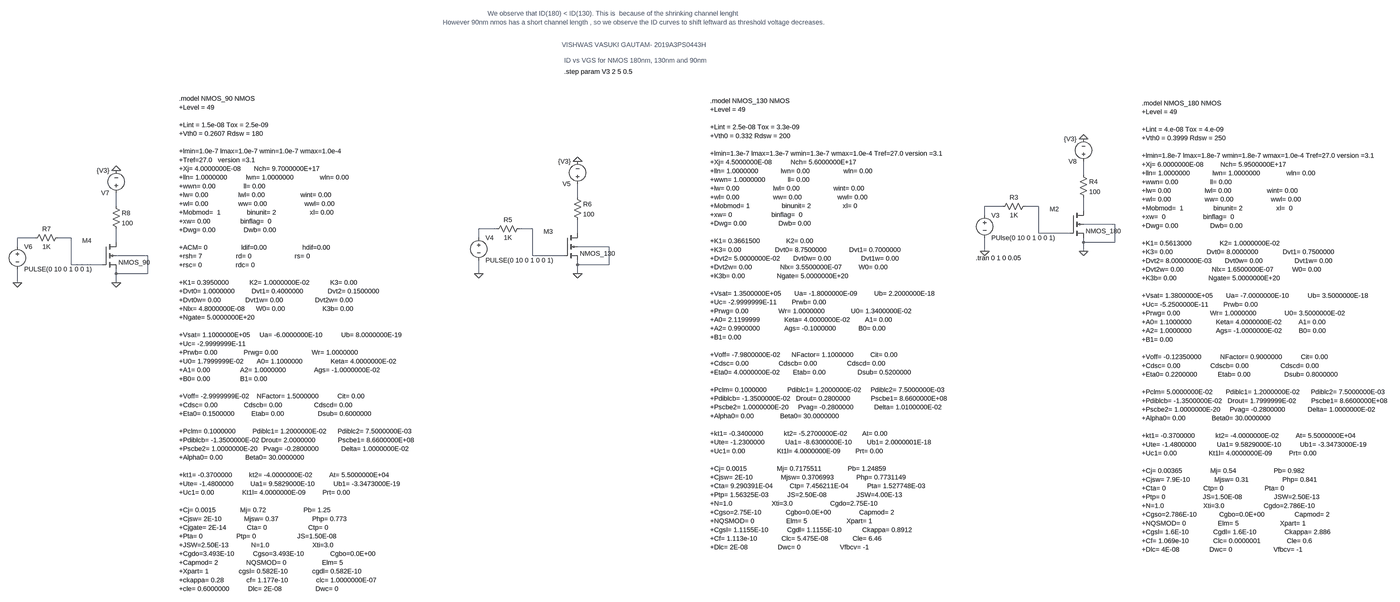
[diagram p0: schematic NMOS_IDvsVGS.asc, whole sheet]
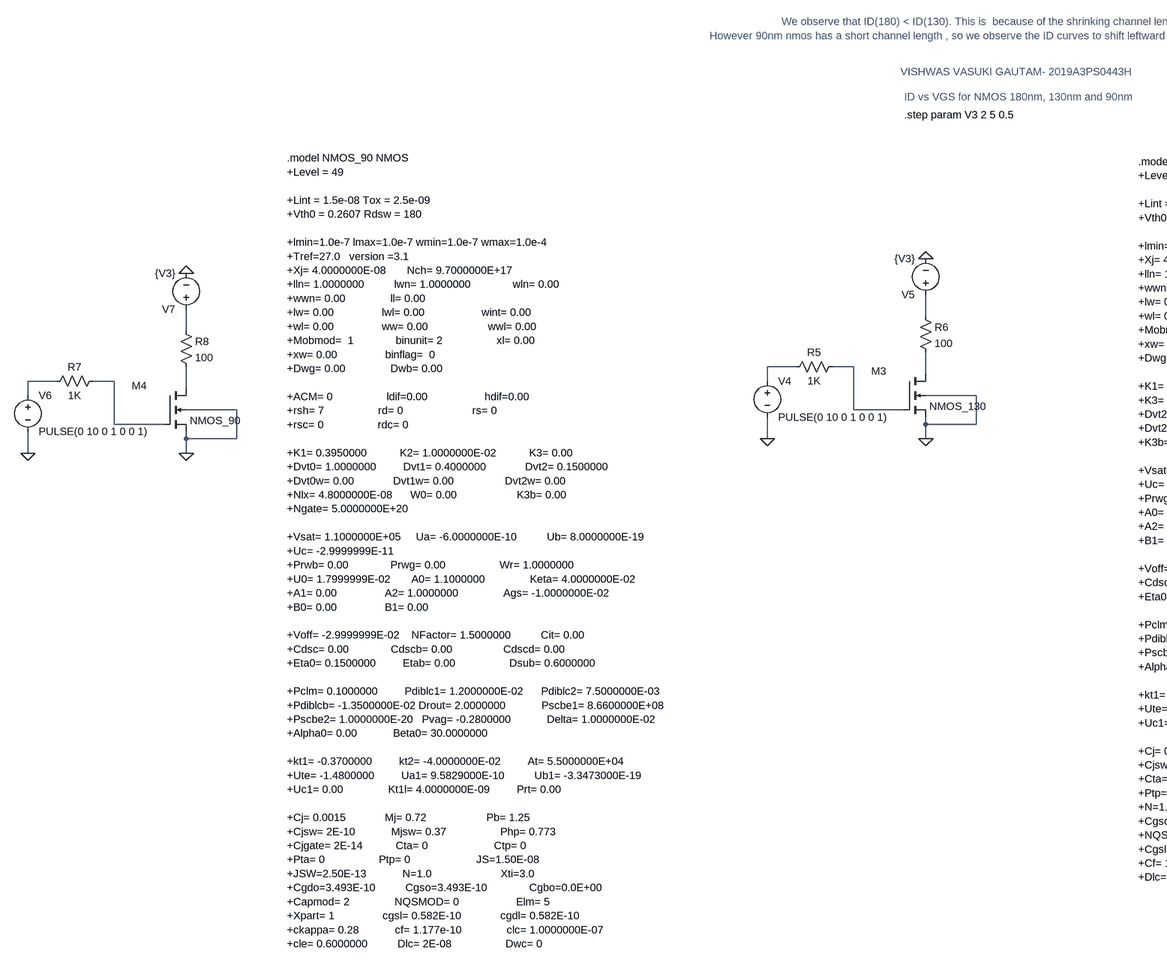
[diagram p1: schematic NMOS_IDvsVGS.asc, part, row 1 of 1, column 1 of 2]
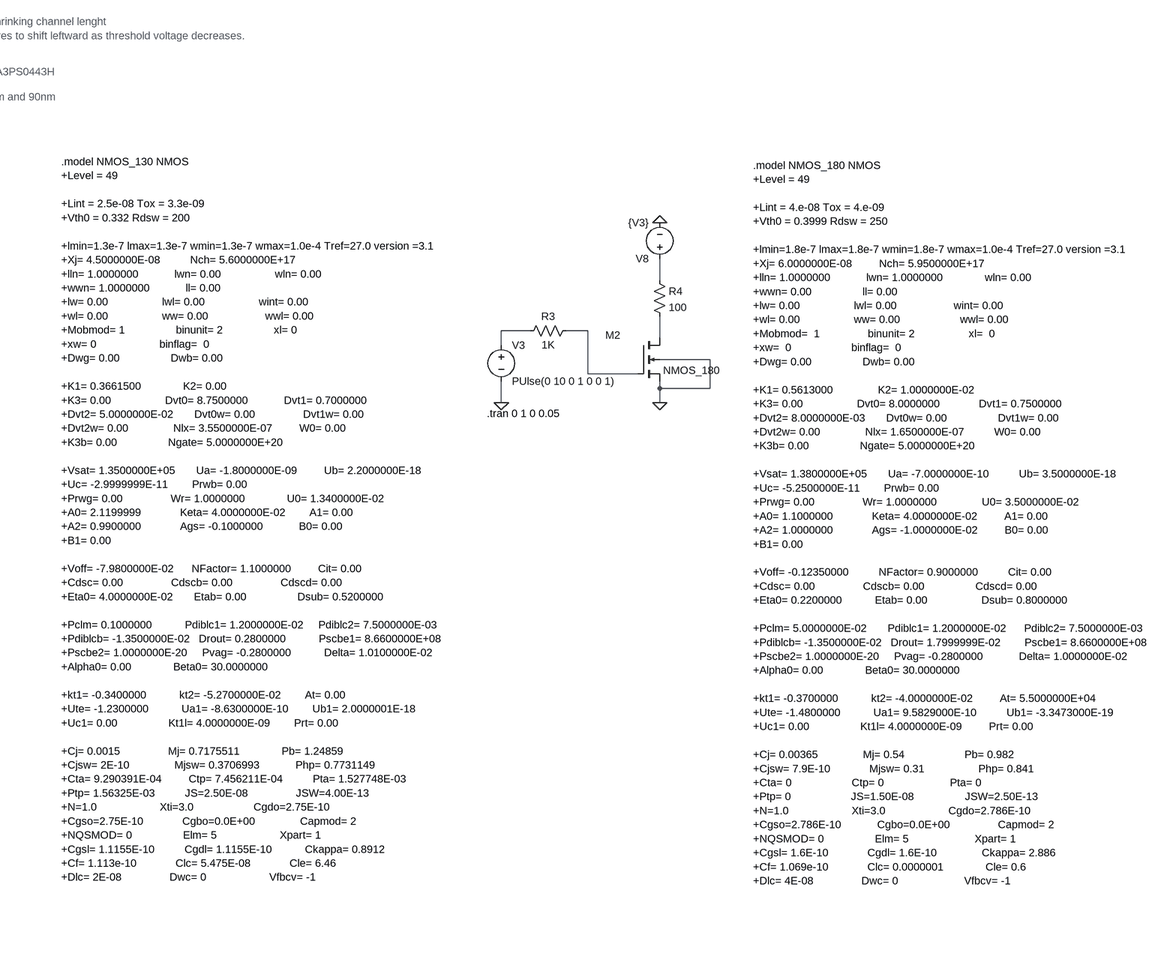
[diagram p2: schematic NMOS_IDvsVGS.asc, part, row 1 of 1, column 2 of 2]
NMOS_IDvsVGS.asc, the LTspice schematic file:
Version 4
SHEET 1 1936 1352
WIRE -608 -240 -608 -288
WIRE -2560 -160 -2560 -208
WIRE -4560 -128 -4560 -176
WIRE -896 -128 -960 -128
WIRE -768 -128 -816 -128
WIRE -608 -112 -608 -160
WIRE -960 -96 -960 -128
WIRE -496 -64 -608 -64
WIRE -2848 -48 -2912 -48
WIRE -2720 -48 -2768 -48
WIRE -2560 -32 -2560 -80
WIRE -768 -32 -768 -128
WIRE -656 -32 -768 -32
WIRE -4848 -16 -4912 -16
WIRE -4720 -16 -4768 -16
WIRE -2912 -16 -2912 -48
WIRE -4560 0 -4560 -48
WIRE -608 0 -608 -16
WIRE -496 0 -496 -64
WIRE -496 0 -608 0
WIRE -4912 16 -4912 -16
WIRE -2448 16 -2560 16
WIRE -960 32 -960 -16
WIRE -608 32 -608 0
WIRE -4448 48 -4560 48
WIRE -2720 48 -2720 -48
WIRE -2608 48 -2720 48
WIRE -4720 80 -4720 -16
WIRE -4608 80 -4720 80
WIRE -2560 80 -2560 64
WIRE -2448 80 -2448 16
WIRE -2448 80 -2560 80
WIRE -4560 112 -4560 96
WIRE -4448 112 -4448 48
WIRE -4448 112 -4560 112
WIRE -2912 112 -2912 64
WIRE -2560 112 -2560 80
WIRE -4912 144 -4912 96
WIRE -4560 144 -4560 112
FLAG -608 32 0
FLAG -960 32 0
FLAG -2560 112 0
FLAG -2912 112 0
FLAG -4560 144 0
FLAG -4912 144 0
FLAG -608 -368 0
FLAG -2560 -288 0
FLAG -4560 -256 0
SYMBOL res -800 -144 R90
WINDOW 0 0 56 VBottom 2
WINDOW 3 32 56 VTop 2
SYMATTR InstName R3
SYMATTR Value 1K
SYMBOL res -624 -256 R0
SYMATTR InstName R4
SYMATTR Value 100
SYMBOL voltage -960 -112 R0
WINDOW 123 0 0 Left 2
WINDOW 39 0 0 Left 2
SYMATTR InstName V3
SYMATTR Value PUlse(0 10 0 1 0 0 1)
SYMBOL nmos4 -656 -112 R0
WINDOW 0 -73 -6 Left 2
SYMATTR InstName M2
SYMATTR Value NMOS_180
SYMATTR Value2 l=0.5u w=10u
SYMBOL res -2752 -64 R90
WINDOW 0 0 56 VBottom 2
WINDOW 3 32 56 VTop 2
SYMATTR InstName R5
SYMATTR Value 1K
SYMBOL res -2576 -176 R0
SYMATTR InstName R6
SYMATTR Value 100
SYMBOL voltage -2912 -32 R0
WINDOW 123 0 0 Left 2
WINDOW 39 0 0 Left 2
SYMATTR InstName V4
SYMATTR Value PULSE(0 10 0 1 0 0 1)
SYMBOL voltage -2560 -192 R180
WINDOW 123 0 0 Left 2
WINDOW 39 0 0 Left 2
SYMATTR InstName V5
SYMATTR Value {V3}
SYMBOL nmos4 -2608 -32 R0
WINDOW 0 -73 -6 Left 2
SYMATTR InstName M3
SYMATTR Value NMOS_130
SYMATTR Value2 l=0.5u w=10u
SYMBOL res -4752 -32 R90
WINDOW 0 0 56 VBottom 2
WINDOW 3 32 56 VTop 2
SYMATTR InstName R7
SYMATTR Value 1K
SYMBOL res -4576 -144 R0
SYMATTR InstName R8
SYMATTR Value 100
SYMBOL voltage -4912 0 R0
WINDOW 123 0 0 Left 2
WINDOW 39 0 0 Left 2
SYMATTR InstName V6
SYMATTR Value PULSE(0 10 0 1 0 0 1)
SYMBOL voltage -4560 -160 R180
WINDOW 123 0 0 Left 2
WINDOW 39 0 0 Left 2
SYMATTR InstName V7
SYMATTR Value {V3}
SYMBOL nmos4 -4608 0 R0
WINDOW 0 -73 -6 Left 2
SYMATTR InstName M4
SYMATTR Value NMOS_90
SYMATTR Value2 l=0.5u w=10u
SYMBOL voltage -608 -272 R180
WINDOW 123 0 0 Left 2
WINDOW 39 0 0 Left 2
SYMATTR InstName V8
SYMATTR Value {V3}
TEXT -992 56 Left 2 !.tran 0 1 0 0.05
TEXT -2608 -608 Left 2 !.step param V3 2 5 0.5
TEXT -2880 -816 Left 2 ;We observe that ID(180) < ID(130). This is  because of the shrinking channel lenght
TEXT -3040 -784 Left 2 ;However 90nm nmos has a short channel length , so we observe the ID curves to shift leftward as threshold voltage decreases.
TEXT -2608 -648 Left 2 ;ID vs VGS for NMOS 180nm, 130nm and 90nm
TEXT -400 -496 Left 2 !.model NMOS_180 NMOS\n+Level = 49\n \n+Lint = 4.e-08 Tox = 4.e-09 \n+Vth0 = 0.3999 Rdsw = 250 \n \n+lmin=1.8e-7 lmax=1.8e-7 wmin=1.8e-7 wmax=1.0e-4 Tref=27.0 version =3.1\n+Xj= 6.0000000E-08         Nch= 5.9500000E+17 \n+lln= 1.0000000            lwn= 1.0000000              wln= 0.00\n+wwn= 0.00                 ll= 0.00\n+lw= 0.00                  lwl= 0.00                   wint= 0.00\n+wl= 0.00                  ww= 0.00                    wwl= 0.00\n+Mobmod=  1                binunit= 2                  xl=  0\n+xw=  0                    binflag=  0\n+Dwg= 0.00                 Dwb= 0.00 \n \n+K1= 0.5613000               K2= 1.0000000E-02 \n+K3= 0.00                  Dvt0= 8.0000000             Dvt1= 0.7500000 \n+Dvt2= 8.0000000E-03       Dvt0w= 0.00                 Dvt1w= 0.00 \n+Dvt2w= 0.00               Nlx= 1.6500000E-07          W0= 0.00 \n+K3b= 0.00                 Ngate= 5.0000000E+20 \n \n+Vsat= 1.3800000E+05       Ua= -7.0000000E-10          Ub= 3.5000000E-18 \n+Uc= -5.2500000E-11        Prwb= 0.00 \n+Prwg= 0.00                Wr= 1.0000000               U0= 3.5000000E-02 \n+A0= 1.1000000             Keta= 4.0000000E-02         A1= 0.00 \n+A2= 1.0000000             Ags= -1.0000000E-02         B0= 0.00 \n+B1= 0.00 \n \n+Voff= -0.12350000          NFactor= 0.9000000          Cit= 0.00 \n+Cdsc= 0.00                Cdscb= 0.00                 Cdscd= 0.00 \n+Eta0= 0.2200000           Etab= 0.00                  Dsub= 0.8000000 \n \n+Pclm= 5.0000000E-02       Pdiblc1= 1.2000000E-02      Pdiblc2= 7.5000000E-03 \n+Pdiblcb= -1.3500000E-02   Drout= 1.7999999E-02        Pscbe1= 8.6600000E+08 \n+Pscbe2= 1.0000000E-20     Pvag= -0.2800000            Delta= 1.0000000E-02 \n+Alpha0= 0.00              Beta0= 30.0000000 \n \n+kt1= -0.3700000           kt2= -4.0000000E-02         At= 5.5000000E+04 \n+Ute= -1.4800000           Ua1= 9.5829000E-10          Ub1= -3.3473000E-19 \n+Uc1= 0.00                 Kt1l= 4.0000000E-09         Prt= 0.00 \n \n+Cj= 0.00365               Mj= 0.54                    Pb= 0.982\n+Cjsw= 7.9E-10             Mjsw= 0.31                  Php= 0.841\n+Cta= 0                    Ctp= 0                      Pta= 0\n+Ptp= 0                    JS=1.50E-08                 JSW=2.50E-13\n+N=1.0                     Xti=3.0                     Cgdo=2.786E-10\n+Cgso=2.786E-10            Cgbo=0.0E+00                Capmod= 2\n+NQSMOD= 0                 Elm= 5                      Xpart= 1\n+Cgsl= 1.6E-10             Cgdl= 1.6E-10               Ckappa= 2.886\n+Cf= 1.069e-10             Clc= 0.0000001              Cle= 0.6\n+Dlc= 4E-08                Dwc= 0                      Vfbcv= -1
TEXT -2088 -504 Left 2 !.model NMOS_130 NMOS\n+Level = 49\n \n+Lint = 2.5e-08 Tox = 3.3e-09 \n+Vth0 = 0.332 Rdsw = 200 \n \n+lmin=1.3e-7 lmax=1.3e-7 wmin=1.3e-7 wmax=1.0e-4 Tref=27.0 version =3.1\n+Xj= 4.5000000E-08          Nch= 5.6000000E+17 \n+lln= 1.0000000            lwn= 0.00                  wln= 0.00\n+wwn= 1.0000000            ll= 0.00\n+lw= 0.00                  lwl= 0.00                  wint= 0.00\n+wl= 0.00                  ww= 0.00                   wwl= 0.00\n+Mobmod= 1                 binunit= 2                 xl= 0\n+xw= 0                     binflag=  0\n+Dwg= 0.00                 Dwb= 0.00 \n \n+K1= 0.3661500              K2= 0.00 \n+K3= 0.00                  Dvt0= 8.7500000            Dvt1= 0.7000000 \n+Dvt2= 5.0000000E-02       Dvt0w= 0.00                Dvt1w= 0.00 \n+Dvt2w= 0.00               Nlx= 3.5500000E-07         W0= 0.00 \n+K3b= 0.00                 Ngate= 5.0000000E+20 \n \n+Vsat= 1.3500000E+05       Ua= -1.8000000E-09         Ub= 2.2000000E-18 \n+Uc= -2.9999999E-11        Prwb= 0.00 \n+Prwg= 0.00                Wr= 1.0000000              U0= 1.3400000E-02 \n+A0= 2.1199999             Keta= 4.0000000E-02        A1= 0.00 \n+A2= 0.9900000             Ags= -0.1000000            B0= 0.00 \n+B1= 0.00 \n \n+Voff= -7.9800000E-02      NFactor= 1.1000000         Cit= 0.00 \n+Cdsc= 0.00                Cdscb= 0.00                Cdscd= 0.00 \n+Eta0= 4.0000000E-02       Etab= 0.00                 Dsub= 0.5200000 \n \n+Pclm= 0.1000000           Pdiblc1= 1.2000000E-02     Pdiblc2= 7.5000000E-03 \n+Pdiblcb= -1.3500000E-02   Drout= 0.2800000           Pscbe1= 8.6600000E+08 \n+Pscbe2= 1.0000000E-20     Pvag= -0.2800000           Delta= 1.0100000E-02 \n+Alpha0= 0.00              Beta0= 30.0000000 \n \n+kt1= -0.3400000           kt2= -5.2700000E-02        At= 0.00 \n+Ute= -1.2300000           Ua1= -8.6300000E-10        Ub1= 2.0000001E-18 \n+Uc1= 0.00                 Kt1l= 4.0000000E-09        Prt= 0.00 \n \n+Cj= 0.0015                Mj= 0.7175511              Pb= 1.24859\n+Cjsw= 2E-10               Mjsw= 0.3706993            Php= 0.7731149\n+Cta= 9.290391E-04         Ctp= 7.456211E-04          Pta= 1.527748E-03\n+Ptp= 1.56325E-03          JS=2.50E-08                JSW=4.00E-13\n+N=1.0                     Xti=3.0                    Cgdo=2.75E-10\n+Cgso=2.75E-10             Cgbo=0.0E+00               Capmod= 2\n+NQSMOD= 0                 Elm= 5                     Xpart= 1\n+Cgsl= 1.1155E-10          Cgdl= 1.1155E-10           Ckappa= 0.8912\n+Cf= 1.113e-10             Clc= 5.475E-08             Cle= 6.46\n+Dlc= 2E-08                Dwc= 0                     Vfbcv= -1
TEXT -4296 -512 Left 2 !.model NMOS_90 NMOS\n+Level = 49\n \n+Lint = 1.5e-08 Tox = 2.5e-09 \n+Vth0 = 0.2607 Rdsw = 180 \n \n+lmin=1.0e-7 lmax=1.0e-7 wmin=1.0e-7 wmax=1.0e-4\n+Tref=27.0   version =3.1\n+Xj= 4.0000000E-08       Nch= 9.7000000E+17 \n+lln= 1.0000000          lwn= 1.0000000              wln= 0.00\n+wwn= 0.00               ll= 0.00\n+lw= 0.00                lwl= 0.00                   wint= 0.00\n+wl= 0.00                ww= 0.00                    wwl= 0.00\n+Mobmod=  1              binunit= 2                  xl= 0.00\n+xw= 0.00                binflag=  0\n+Dwg= 0.00               Dwb= 0.00 \n \n+ACM= 0                  ldif=0.00                   hdif=0.00\n+rsh= 7                  rd= 0                       rs= 0\n+rsc= 0                  rdc= 0\n \n+K1= 0.3950000           K2= 1.0000000E-02           K3= 0.00 \n+Dvt0= 1.0000000         Dvt1= 0.4000000             Dvt2= 0.1500000 \n+Dvt0w= 0.00             Dvt1w= 0.00                 Dvt2w= 0.00 \n+Nlx= 4.8000000E-08      W0= 0.00                    K3b= 0.00 \n+Ngate= 5.0000000E+20 \n \n+Vsat= 1.1000000E+05     Ua= -6.0000000E-10          Ub= 8.0000000E-19 \n+Uc= -2.9999999E-11       \n+Prwb= 0.00              Prwg= 0.00                  Wr= 1.0000000 \n+U0= 1.7999999E-02       A0= 1.1000000               Keta= 4.0000000E-02 \n+A1= 0.00                A2= 1.0000000               Ags= -1.0000000E-02\n+B0= 0.00                B1= 0.00 \n \n+Voff= -2.9999999E-02    NFactor= 1.5000000          Cit= 0.00 \n+Cdsc= 0.00              Cdscb= 0.00                 Cdscd= 0.00 \n+Eta0= 0.1500000         Etab= 0.00                  Dsub= 0.6000000 \n \n+Pclm= 0.1000000         Pdiblc1= 1.2000000E-02      Pdiblc2= 7.5000000E-03\n+Pdiblcb= -1.3500000E-02 Drout= 2.0000000            Pscbe1= 8.6600000E+08\n+Pscbe2= 1.0000000E-20   Pvag= -0.2800000            Delta= 1.0000000E-02\n+Alpha0= 0.00            Beta0= 30.0000000 \n \n+kt1= -0.3700000         kt2= -4.0000000E-02         At= 5.5000000E+04 \n+Ute= -1.4800000         Ua1= 9.5829000E-10          Ub1= -3.3473000E-19\n+Uc1= 0.00               Kt1l= 4.0000000E-09         Prt= 0.00 \n \n+Cj= 0.0015             Mj= 0.72                    Pb= 1.25 \n+Cjsw= 2E-10            Mjsw= 0.37                  Php= 0.773\n+Cjgate= 2E-14           Cta= 0                      Ctp= 0\n+Pta= 0                  Ptp= 0                      JS=1.50E-08\n+JSW=2.50E-13            N=1.0                       Xti=3.0\n+Cgdo=3.493E-10          Cgso=3.493E-10              Cgbo=0.0E+00\n+Capmod= 2               NQSMOD= 0                   Elm= 5\n+Xpart= 1                cgsl= 0.582E-10             cgdl= 0.582E-10\n+ckappa= 0.28            cf= 1.177e-10               clc= 1.0000000E-07\n+cle= 0.6000000          Dlc= 2E-08                  Dwc= 0
TEXT -2616 -704 Left 2 ;VISHWAS VASUKI GAUTAM- 2019A3PS0443H

The netlist it stands for:
* NMOS_IDvsVGS.asc
R3 N005 N004 1K
R4 N001 N006 100
V3 N004 0 PUlse(0 10 0 1 0 0 1)
M2 N006 N005 0 0 NMOS_180 l=0.5u w=10u
R5 N008 N007 1K
R6 N002 N009 100
V4 N007 0 PULSE(0 10 0 1 0 0 1)
V5 N002 0 {V3}
M3 N009 N008 0 0 NMOS_130 l=0.5u w=10u
R7 N011 N010 1K
R8 N003 N012 100
V6 N010 0 PULSE(0 10 0 1 0 0 1)
V7 N003 0 {V3}
M4 N012 N011 0 0 NMOS_90 l=0.5u w=10u
V8 N001 0 {V3}
.model NMOS NMOS
.model PMOS PMOS
.lib standard.mos
.tran 0 1 0 0.05
.step param V3 2 5 0.5
* We observe that ID(180) < ID(130). This is  because of the shrinking channel lenght
* However 90nm nmos has a short channel length , so we observe the ID curves to shift leftward as threshold voltage decreases.
* ID vs VGS for NMOS 180nm, 130nm and 90nm
.model NMOS_180 NMOS
+Level = 49
+Lint = 4.e-08 Tox = 4.e-09
+Vth0 = 0.3999 Rdsw = 250
+lmin=1.8e-7 lmax=1.8e-7 wmin=1.8e-7 wmax=1.0e-4 Tref=27.0 version =3.1
+Xj= 6.0000000E-08         Nch= 5.9500000E+17
+lln= 1.0000000            lwn= 1.0000000              wln= 0.00
+wwn= 0.00                 ll= 0.00
+lw= 0.00                  lwl= 0.00                   wint= 0.00
+wl= 0.00                  ww= 0.00                    wwl= 0.00
+Mobmod=  1                binunit= 2                  xl=  0
+xw=  0                    binflag=  0
+Dwg= 0.00                 Dwb= 0.00
+K1= 0.5613000               K2= 1.0000000E-02
+K3= 0.00                  Dvt0= 8.0000000             Dvt1= 0.7500000
+Dvt2= 8.0000000E-03       Dvt0w= 0.00                 Dvt1w= 0.00
+Dvt2w= 0.00               Nlx= 1.6500000E-07          W0= 0.00
+K3b= 0.00                 Ngate= 5.0000000E+20
+Vsat= 1.3800000E+05       Ua= -7.0000000E-10          Ub= 3.5000000E-18
+Uc= -5.2500000E-11        Prwb= 0.00
+Prwg= 0.00                Wr= 1.0000000               U0= 3.5000000E-02
+A0= 1.1000000             Keta= 4.0000000E-02         A1= 0.00
+A2= 1.0000000             Ags= -1.0000000E-02         B0= 0.00
+B1= 0.00
+Voff= -0.12350000          NFactor= 0.9000000          Cit= 0.00
+Cdsc= 0.00                Cdscb= 0.00                 Cdscd= 0.00
+Eta0= 0.2200000           Etab= 0.00                  Dsub= 0.8000000
+Pclm= 5.0000000E-02       Pdiblc1= 1.2000000E-02      Pdiblc2= 7.5000000E-03
+Pdiblcb= -1.3500000E-02   Drout= 1.7999999E-02        Pscbe1= 8.6600000E+08
+Pscbe2= 1.0000000E-20     Pvag= -0.2800000            Delta= 1.0000000E-02
+Alpha0= 0.00              Beta0= 30.0000000
+kt1= -0.3700000           kt2= -4.0000000E-02         At= 5.5000000E+04
+Ute= -1.4800000           Ua1= 9.5829000E-10          Ub1= -3.3473000E-19
+Uc1= 0.00                 Kt1l= 4.0000000E-09         Prt= 0.00
+Cj= 0.00365               Mj= 0.54                    Pb= 0.982
+Cjsw= 7.9E-10             Mjsw= 0.31                  Php= 0.841
+Cta= 0                    Ctp= 0                      Pta= 0
+Ptp= 0                    JS=1.50E-08                 JSW=2.50E-13
+N=1.0                     Xti=3.0                     Cgdo=2.786E-10
+Cgso=2.786E-10            Cgbo=0.0E+00                Capmod= 2
+NQSMOD= 0                 Elm= 5                      Xpart= 1
+Cgsl= 1.6E-10             Cgdl= 1.6E-10               Ckappa= 2.886
+Cf= 1.069e-10             Clc= 0.0000001              Cle= 0.6
+Dlc= 4E-08                Dwc= 0                      Vfbcv= -1
.model NMOS_130 NMOS
+Level = 49
+Lint = 2.5e-08 Tox = 3.3e-09
+Vth0 = 0.332 Rdsw = 200
+lmin=1.3e-7 lmax=1.3e-7 wmin=1.3e-7 wmax=1.0e-4 Tref=27.0 version =3.1
+Xj= 4.5000000E-08          Nch= 5.6000000E+17
+lln= 1.0000000            lwn= 0.00                  wln= 0.00
+wwn= 1.0000000            ll= 0.00
+lw= 0.00                  lwl= 0.00                  wint= 0.00
+wl= 0.00                  ww= 0.00                   wwl= 0.00
+Mobmod= 1                 binunit= 2                 xl= 0
+xw= 0                     binflag=  0
+Dwg= 0.00                 Dwb= 0.00
+K1= 0.3661500              K2= 0.00
+K3= 0.00                  Dvt0= 8.7500000            Dvt1= 0.7000000
+Dvt2= 5.0000000E-02       Dvt0w= 0.00                Dvt1w= 0.00
+Dvt2w= 0.00               Nlx= 3.5500000E-07         W0= 0.00
+K3b= 0.00                 Ngate= 5.0000000E+20
+Vsat= 1.3500000E+05       Ua= -1.8000000E-09         Ub= 2.2000000E-18
+Uc= -2.9999999E-11        Prwb= 0.00
+Prwg= 0.00                Wr= 1.0000000              U0= 1.3400000E-02
+A0= 2.1199999             Keta= 4.0000000E-02        A1= 0.00
+A2= 0.9900000             Ags= -0.1000000            B0= 0.00
+B1= 0.00
+Voff= -7.9800000E-02      NFactor= 1.1000000         Cit= 0.00
+Cdsc= 0.00                Cdscb= 0.00                Cdscd= 0.00
+Eta0= 4.0000000E-02       Etab= 0.00                 Dsub= 0.5200000
+Pclm= 0.1000000           Pdiblc1= 1.2000000E-02     Pdiblc2= 7.5000000E-03
+Pdiblcb= -1.3500000E-02   Drout= 0.2800000           Pscbe1= 8.6600000E+08
+Pscbe2= 1.0000000E-20     Pvag= -0.2800000           Delta= 1.0100000E-02
+Alpha0= 0.00              Beta0= 30.0000000
+kt1= -0.3400000           kt2= -5.2700000E-02        At= 0.00
+Ute= -1.2300000           Ua1= -8.6300000E-10        Ub1= 2.0000001E-18
+Uc1= 0.00                 Kt1l= 4.0000000E-09        Prt= 0.00
+Cj= 0.0015                Mj= 0.7175511              Pb= 1.24859
+Cjsw= 2E-10               Mjsw= 0.3706993            Php= 0.7731149
+Cta= 9.290391E-04         Ctp= 7.456211E-04          Pta= 1.527748E-03
+Ptp= 1.56325E-03          JS=2.50E-08                JSW=4.00E-13
+N=1.0                     Xti=3.0                    Cgdo=2.75E-10
+Cgso=2.75E-10             Cgbo=0.0E+00               Capmod= 2
+NQSMOD= 0                 Elm= 5                     Xpart= 1
+Cgsl= 1.1155E-10          Cgdl= 1.1155E-10           Ckappa= 0.8912
+Cf= 1.113e-10             Clc= 5.475E-08             Cle= 6.46
+Dlc= 2E-08                Dwc= 0                     Vfbcv= -1
.model NMOS_90 NMOS
+Level = 49
+Lint = 1.5e-08 Tox = 2.5e-09
+Vth0 = 0.2607 Rdsw = 180
+lmin=1.0e-7 lmax=1.0e-7 wmin=1.0e-7 wmax=1.0e-4
+Tref=27.0   version =3.1
+Xj= 4.0000000E-08       Nch= 9.7000000E+17
+lln= 1.0000000          lwn= 1.0000000              wln= 0.00
+wwn= 0.00               ll= 0.00
+lw= 0.00                lwl= 0.00                   wint= 0.00
+wl= 0.00                ww= 0.00                    wwl= 0.00
+Mobmod=  1              binunit= 2                  xl= 0.00
+xw= 0.00                binflag=  0
+Dwg= 0.00               Dwb= 0.00
+ACM= 0                  ldif=0.00                   hdif=0.00
+rsh= 7                  rd= 0                       rs= 0
+rsc= 0                  rdc= 0
+K1= 0.3950000           K2= 1.0000000E-02           K3= 0.00
+Dvt0= 1.0000000         Dvt1= 0.4000000             Dvt2= 0.1500000
+Dvt0w= 0.00             Dvt1w= 0.00                 Dvt2w= 0.00
+Nlx= 4.8000000E-08      W0= 0.00                    K3b= 0.00
+Ngate= 5.0000000E+20
+Vsat= 1.1000000E+05     Ua= -6.0000000E-10          Ub= 8.0000000E-19
+Uc= -2.9999999E-11
+Prwb= 0.00              Prwg= 0.00                  Wr= 1.0000000
+U0= 1.7999999E-02       A0= 1.1000000               Keta= 4.0000000E-02
+A1= 0.00                A2= 1.0000000               Ags= -1.0000000E-02
+B0= 0.00                B1= 0.00
+Voff= -2.9999999E-02    NFactor= 1.5000000          Cit= 0.00
+Cdsc= 0.00              Cdscb= 0.00                 Cdscd= 0.00
+Eta0= 0.1500000         Etab= 0.00                  Dsub= 0.6000000
+Pclm= 0.1000000         Pdiblc1= 1.2000000E-02      Pdiblc2= 7.5000000E-03
+Pdiblcb= -1.3500000E-02 Drout= 2.0000000            Pscbe1= 8.6600000E+08
+Pscbe2= 1.0000000E-20   Pvag= -0.2800000            Delta= 1.0000000E-02
+Alpha0= 0.00            Beta0= 30.0000000
+kt1= -0.3700000         kt2= -4.0000000E-02         At= 5.5000000E+04
+Ute= -1.4800000         Ua1= 9.5829000E-10          Ub1= -3.3473000E-19
+Uc1= 0.00               Kt1l= 4.0000000E-09         Prt= 0.00
+Cj= 0.0015             Mj= 0.72                    Pb= 1.25
+Cjsw= 2E-10            Mjsw= 0.37                  Php= 0.773
+Cjgate= 2E-14           Cta= 0                      Ctp= 0
+Pta= 0                  Ptp= 0                      JS=1.50E-08
+JSW=2.50E-13            N=1.0                       Xti=3.0
+Cgdo=3.493E-10          Cgso=3.493E-10              Cgbo=0.0E+00
+Capmod= 2               NQSMOD= 0                   Elm= 5
+Xpart= 1                cgsl= 0.582E-10             cgdl= 0.582E-10
+ckappa= 0.28            cf= 1.177e-10               clc= 1.0000000E-07
+cle= 0.6000000          Dlc= 2E-08                  Dwc= 0
* VISHWAS VASUKI GAUTAM- 2019A3PS0443H
.backanno
.end